# EAGLE design Unbricker (EAGLE 7.4.0)
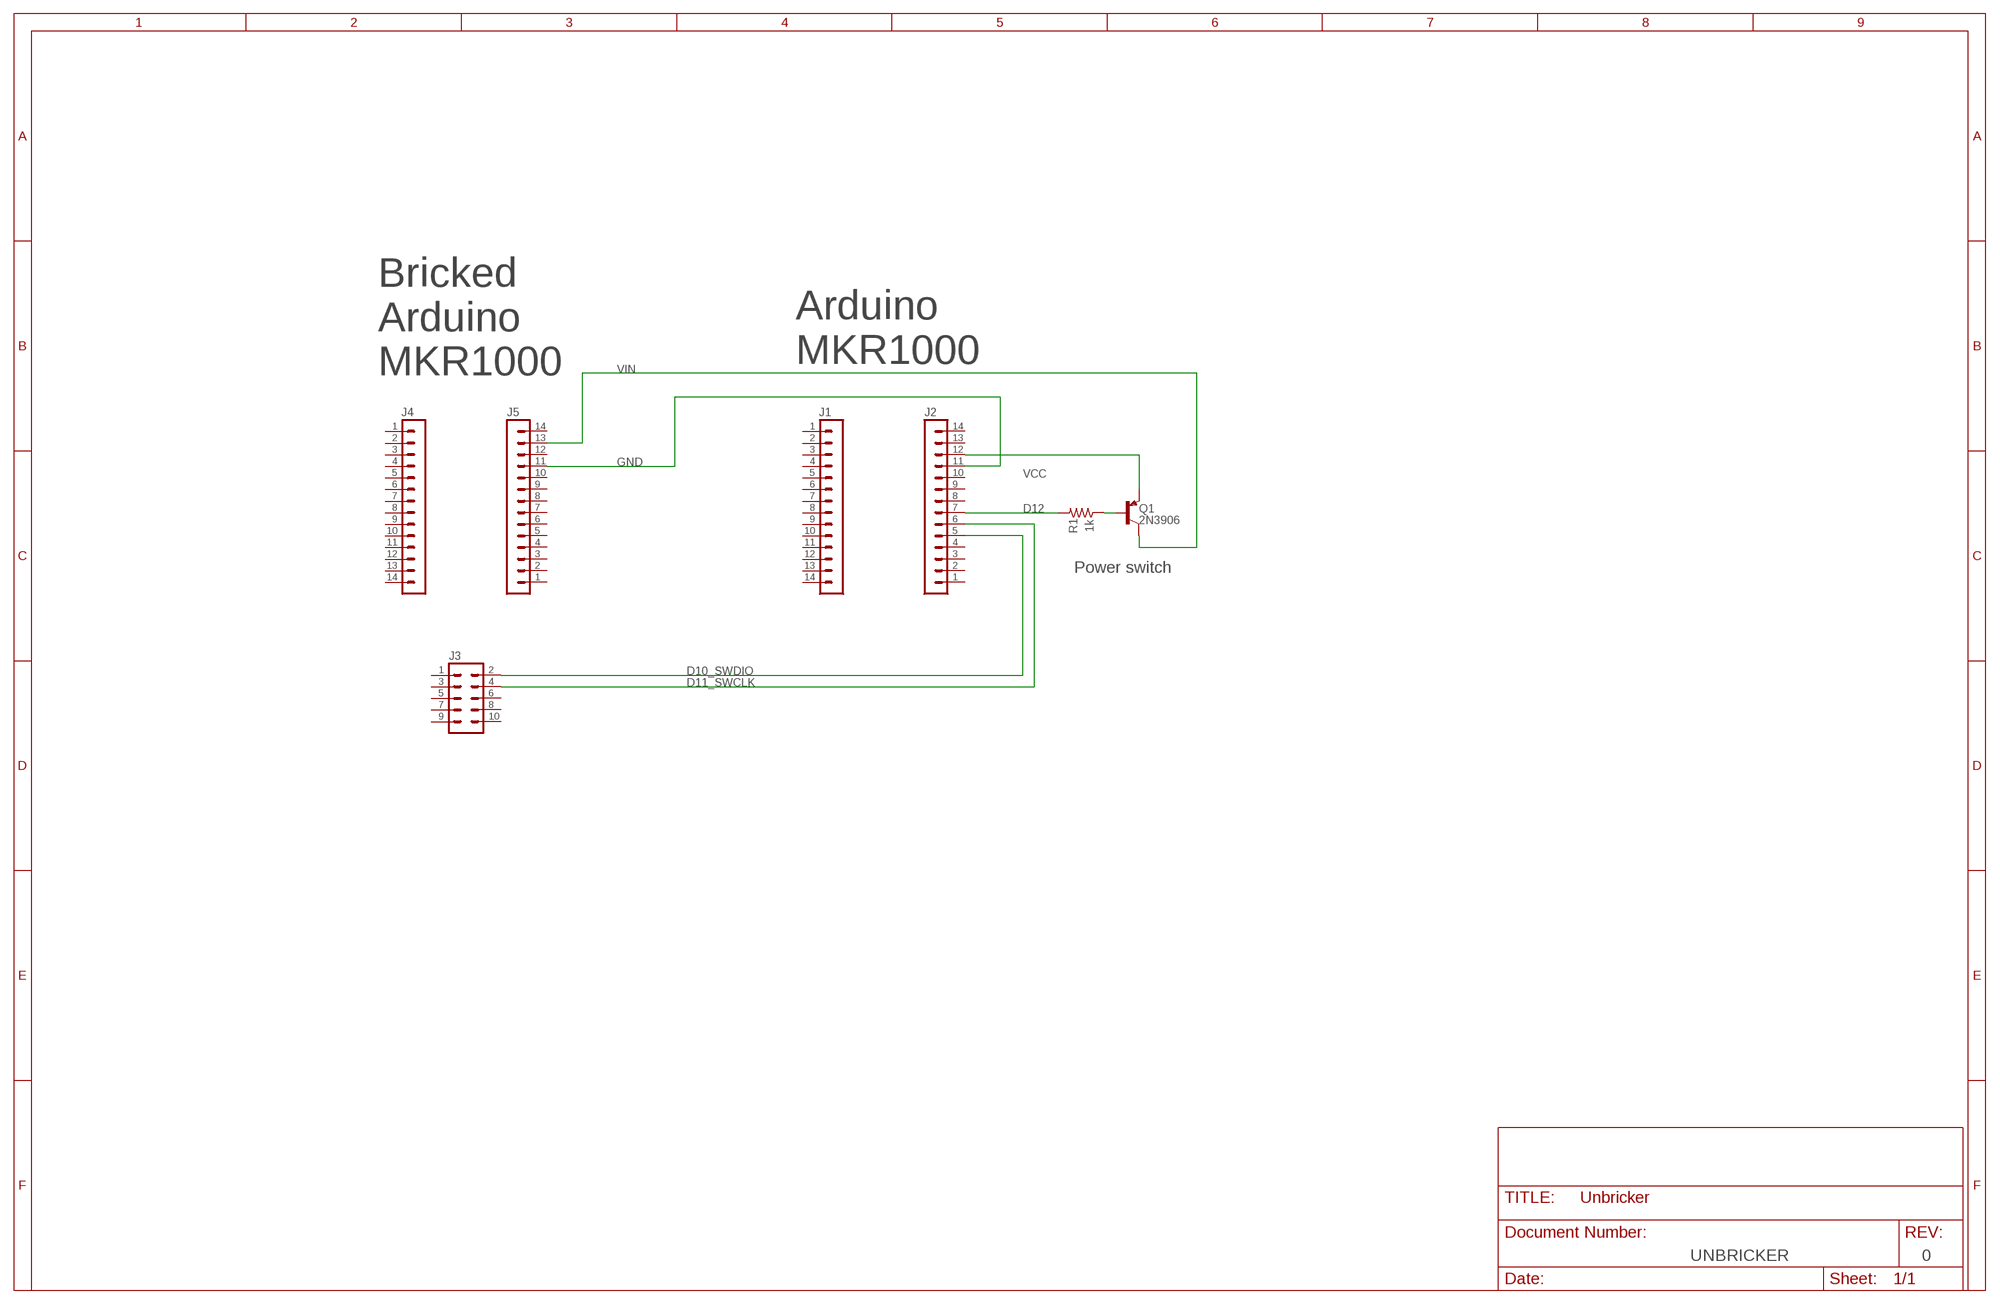
[diagram p0: schematic, sheet 1]

## Parts
J1  MA14-1  [MA14-1]
J2  MA14-1  [MA14-1]
J3  M50-3600542  [FCI-MINITEK127HDR-10]
J4  MA14-1  [MA14-1]
J5  MA14-1  [MA14-1]
Q1  2N3906  PNPMMBT3906  [SOT23]
R1  1k  RB  [R0603]

## Nets
D10_SWDIO: J2.5 J3.2
D11_SWCLK: J2.6 J3.4
D12: J2.7 R1.2
GND: J2.11 J5.11
N$3: Q1.1(B) R1.1
VCC: J2.12 Q1.3(E)
VIN: J5.13 Q1.2(C)
Unconnected: J1.1 J1.2 J1.3 J1.4 J1.5 J1.6 J1.7 J1.8 J1.9 J1.10 J1.11 J1.12 J1.13 J1.14 J2.1 J2.2 J2.3 J2.4 J2.8 J2.9 J2.10 J2.13 J2.14 J3.1 J3.3 J3.5 J3.6 J3.7 J3.8 J3.9 J3.10 J4.1 J4.2 J4.3 J4.4 J4.5 J4.6 J4.7 J4.8 J4.9 J4.10 J4.11 J4.12 J4.13 J4.14 J5.1 J5.2 J5.3 J5.4 J5.5 J5.6 J5.7 J5.8 J5.9 J5.10 J5.12 J5.14

## Notes on the sheet
- Arduino
  MKR1000
- Bricked
  Arduino
  MKR1000
- Power switch
- UNBRICKER | 0

## Library data of the parts
J1 J2 J4 J5 = studio_h:MA14-1
J3 = MK1_Zero:M50-3600542; DESCR: STRIP 1.27MM VERT SMD 5x2POS; MF: Harwin; MPN: M50-3600542
Q1 = studio_h:PNP: PNP Transistor; MF: FAIRCHILD; MPN: MMBT3906; Z_DIGIKEY: MMBT3906FSCT-ND; Z_MOUSER: 512-MMBT3906; Z_SMT: Y
R1 = studio_h:R: Resistor; Z_SMT: Y

## Net classes
0 Signal: width 0.254 mm, clearance 0.205 mm
1 Power: width 0.508 mm, clearance 0.205 mm to class 0, clearance 0.205 mm
2 GND: width 0.889 mm

## Board
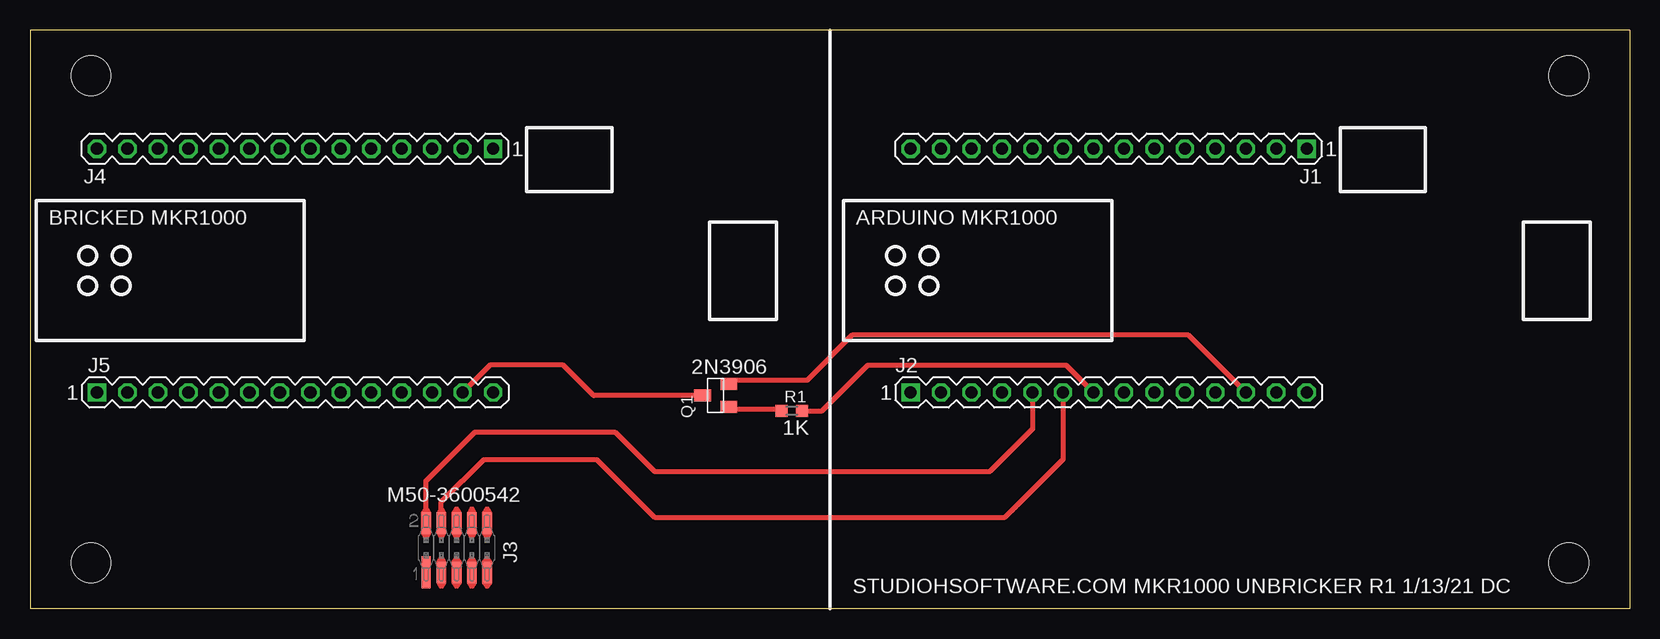
[diagram p1: board, top side]
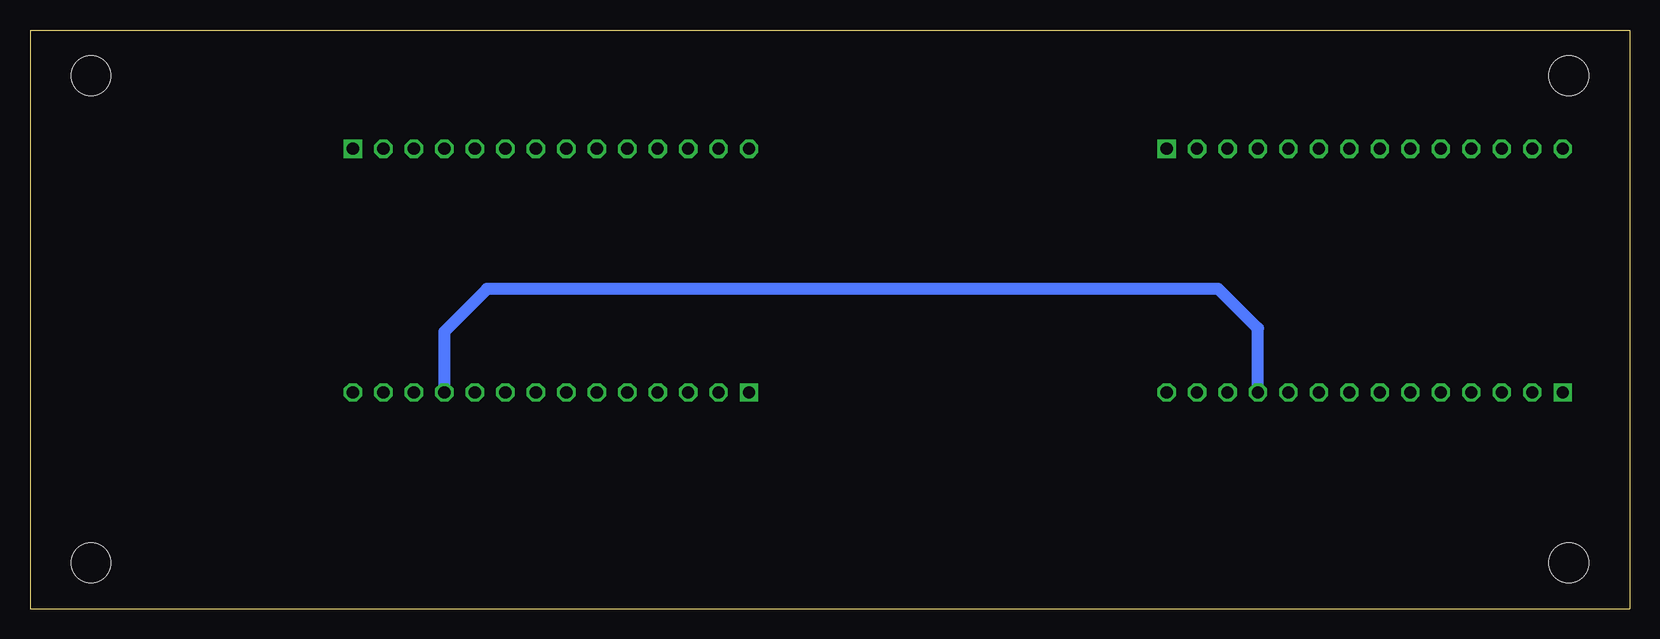
[diagram p2: board, bottom side, seen from below]

Size 133.35 x 48.26 mm. Coordinates in mm from the lower left corner, seen from the top.
Outline: 133.35,48.26 0,48.26 0,0 133.35,0 133.35,48.26
Copper layers (1*16): Top 0.035mm / dielectric 0.2mm / Bottom 0.035mm
Design rules "default *": minimum track width 10mil, minimum drill 20mil, track to track 8mil, track to pad 8mil, pad to pad 8mil, via to via 8mil, smd to smd 8mil, copper to edge 40mil, drill to drill 8mil, minimum pad ring 10mil, minimum via ring 8mil, stop-mask expansion 4mil, vias tented up to drill 0mil, thermal gap 10mil
Holes 3.3 mm at 128.27,44.45 128.27,3.81 5.08,3.81 5.08,44.45

### Footprints (pad centres in the part's own frame; a part is rotated, then mirrored left to right if it is on the bottom)
MA14-1 = drill 1.016 square: 1 0,0 | drill 1.016 octagon: 2 2.54,0; 3 5.08,0; 4 7.62,0; 5 10.16,0; 6 12.7,0; 7 15.24,0; 8 17.78,0; 9 20.32,0; 10 22.86,0; 11 25.4,0; 12 27.94,0; 13 30.48,0; 14 33.02,0
FCI-MINITEK127HDR-10 = smd 2.6 x 0.8: 1 -2.05,2.54 | smd 1.732 x 0.8: 2 2.05,2.54; 3 -2.05,1.27; 4 2.05,1.27; 5 -2.05,0; 6 2.05,0; 7 -2.05,-1.27; 8 2.05,-1.27; 9 -2.05,-2.54; 10 2.05,-2.54
SOT23 = smd 1 x 1.4: 1 -0.95,-1.1; 2 0,1.1; 3 0.95,-1.1
R0603 = smd 1 x 1: 1 -0.85,0; 2 0.85,0

### Placement (x,y rotation side)
J1  106.43,38.35 180 top
J2  73.41,18.03 0 top
J3  35.56,5.08 90 top
J4  38.61,38.35 180 top
J5  5.59,18.03 0 top
Q1  57.15,17.78 90 top
R1  63.5,16.51 0 top

### Tracks (layer width: path | path; a pad name or v marks a point on that pad's centre or on a via)
D10_SWDIO
  Top 0.406: J3.2 33.02,10.67 37.08,14.73 48.77,14.73 52.07,11.43 80.01,11.43 83.57,14.99 J2.5
D11_SWCLK
  Top 0.406: J3.4 34.29,8.89 37.85,12.45 47.24,12.45 52.07,7.62 81.28,7.62 86.11,12.45 J2.6
D12
  Top 0.406: R1.2 66.04,16.51 69.85,20.32 86.36,20.32 J2.7
GND
  Bottom 1.016: J5.11 30.99,23.37 34.29,26.67 95.25,26.67 98.81,23.11 J2.11
N$3
  Top 0.406: Q1.1 58.42,16.66 62.5,16.66 R1.1
VCC
  Top 0.406: Q1.3 58.57,19.05 64.77,19.05 68.58,22.86 96.52,22.86 J2.12
VIN
  Top 0.406: Q1.2 46.99,17.78 44.45,20.32 38.35,20.32 J5.13

### Text on the board
tNames: BRICKED MKR1000 | ARDUINO MKR1000 | 2N3906 | 1K | M50-3600542 | STUDIOHSOFTWARE.COM MKR1000 UNBRICKER R1 1/13/21 DC